# EAGLE board Arduino UNO R4 WIFI-Adavanced KIT V1.0 (EAGLE 9.5.1), part 1 of 2
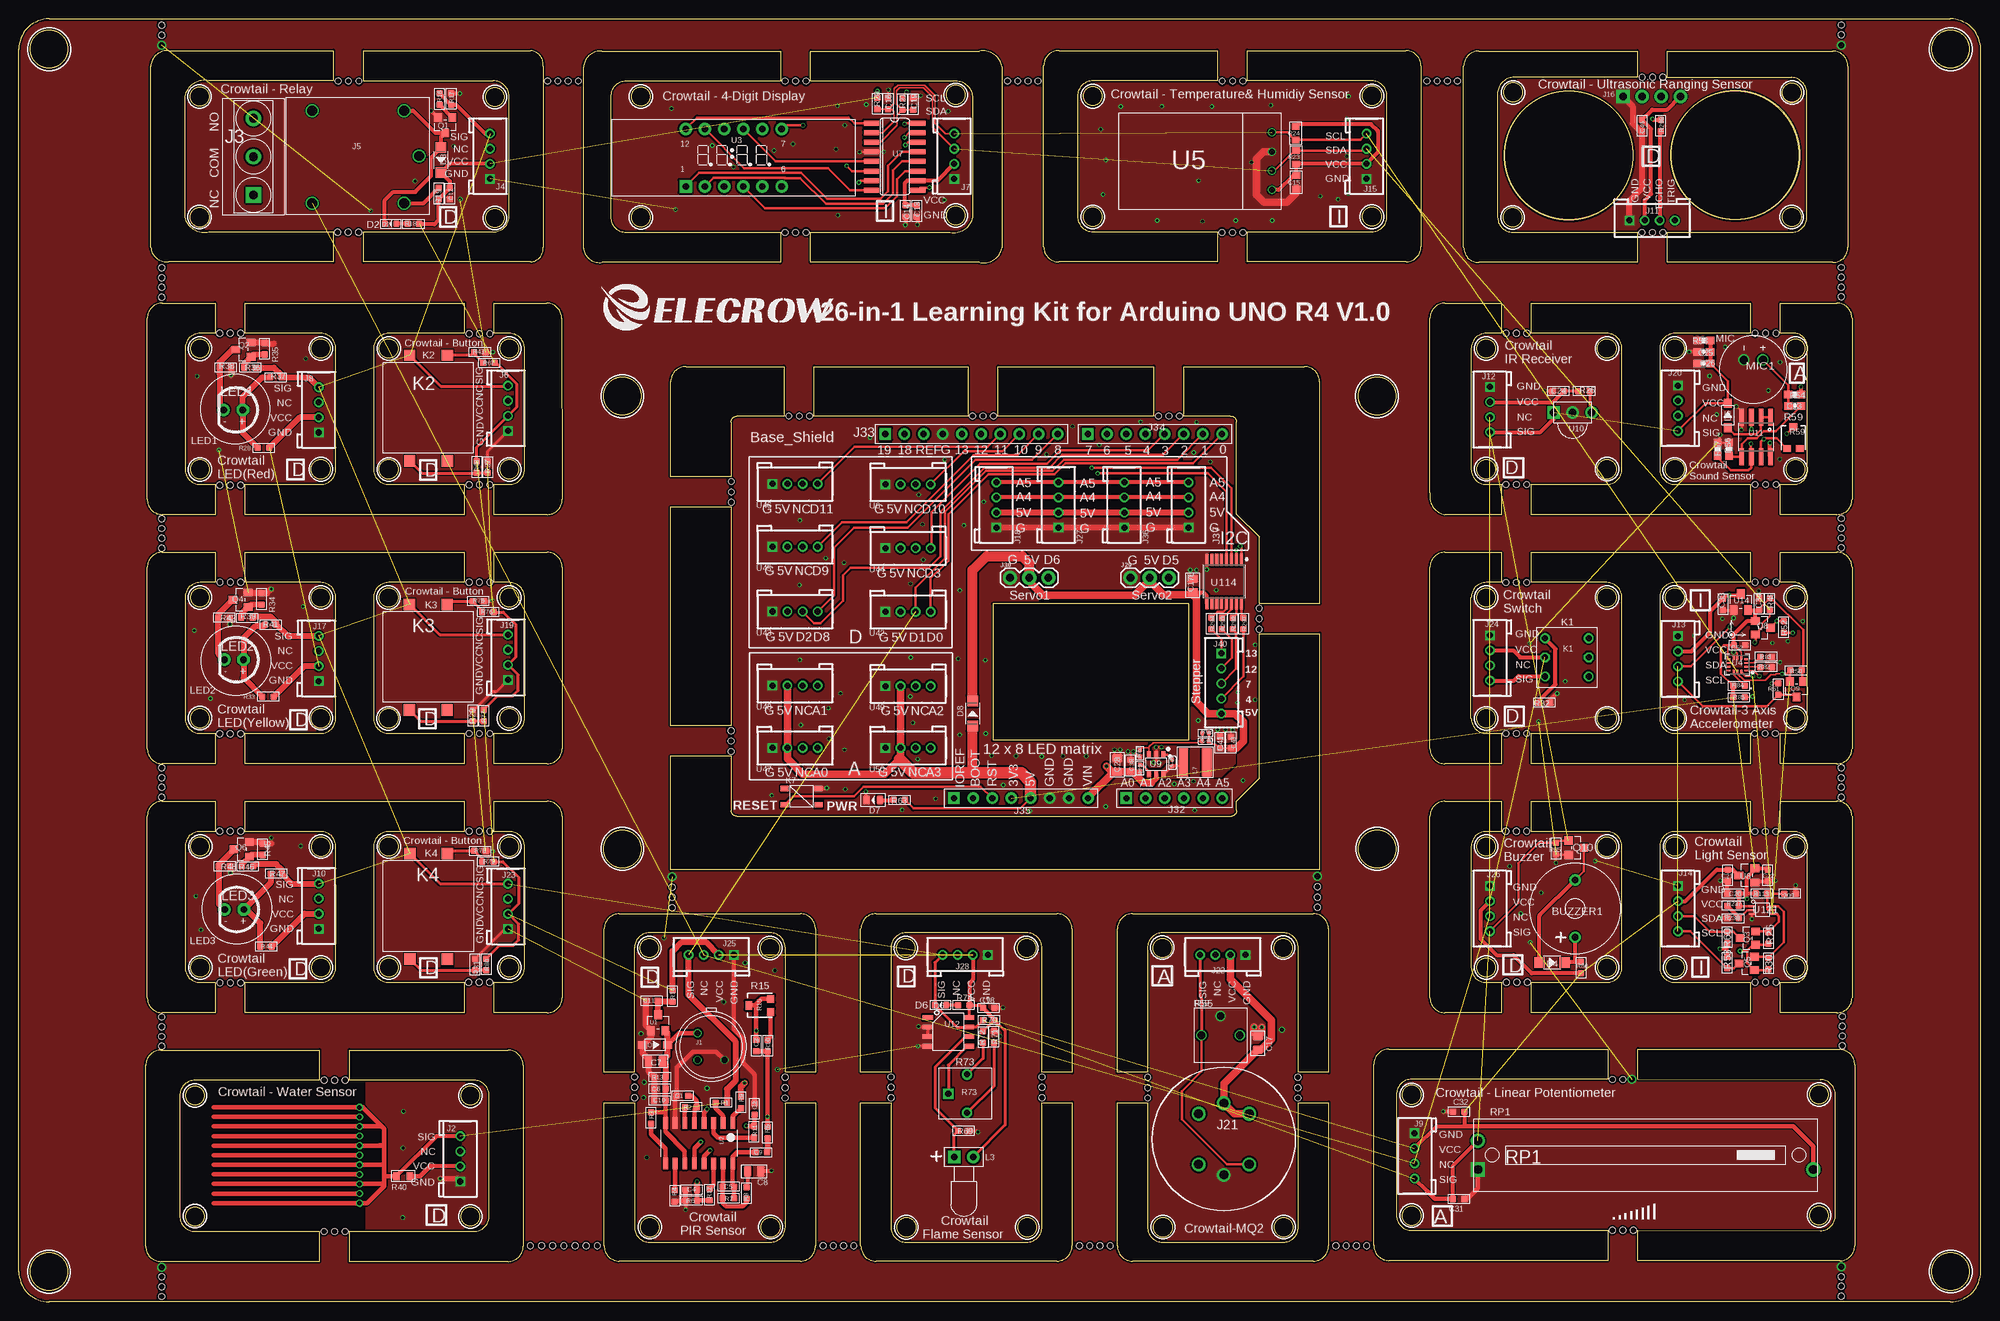
[diagram p5: board, top side]
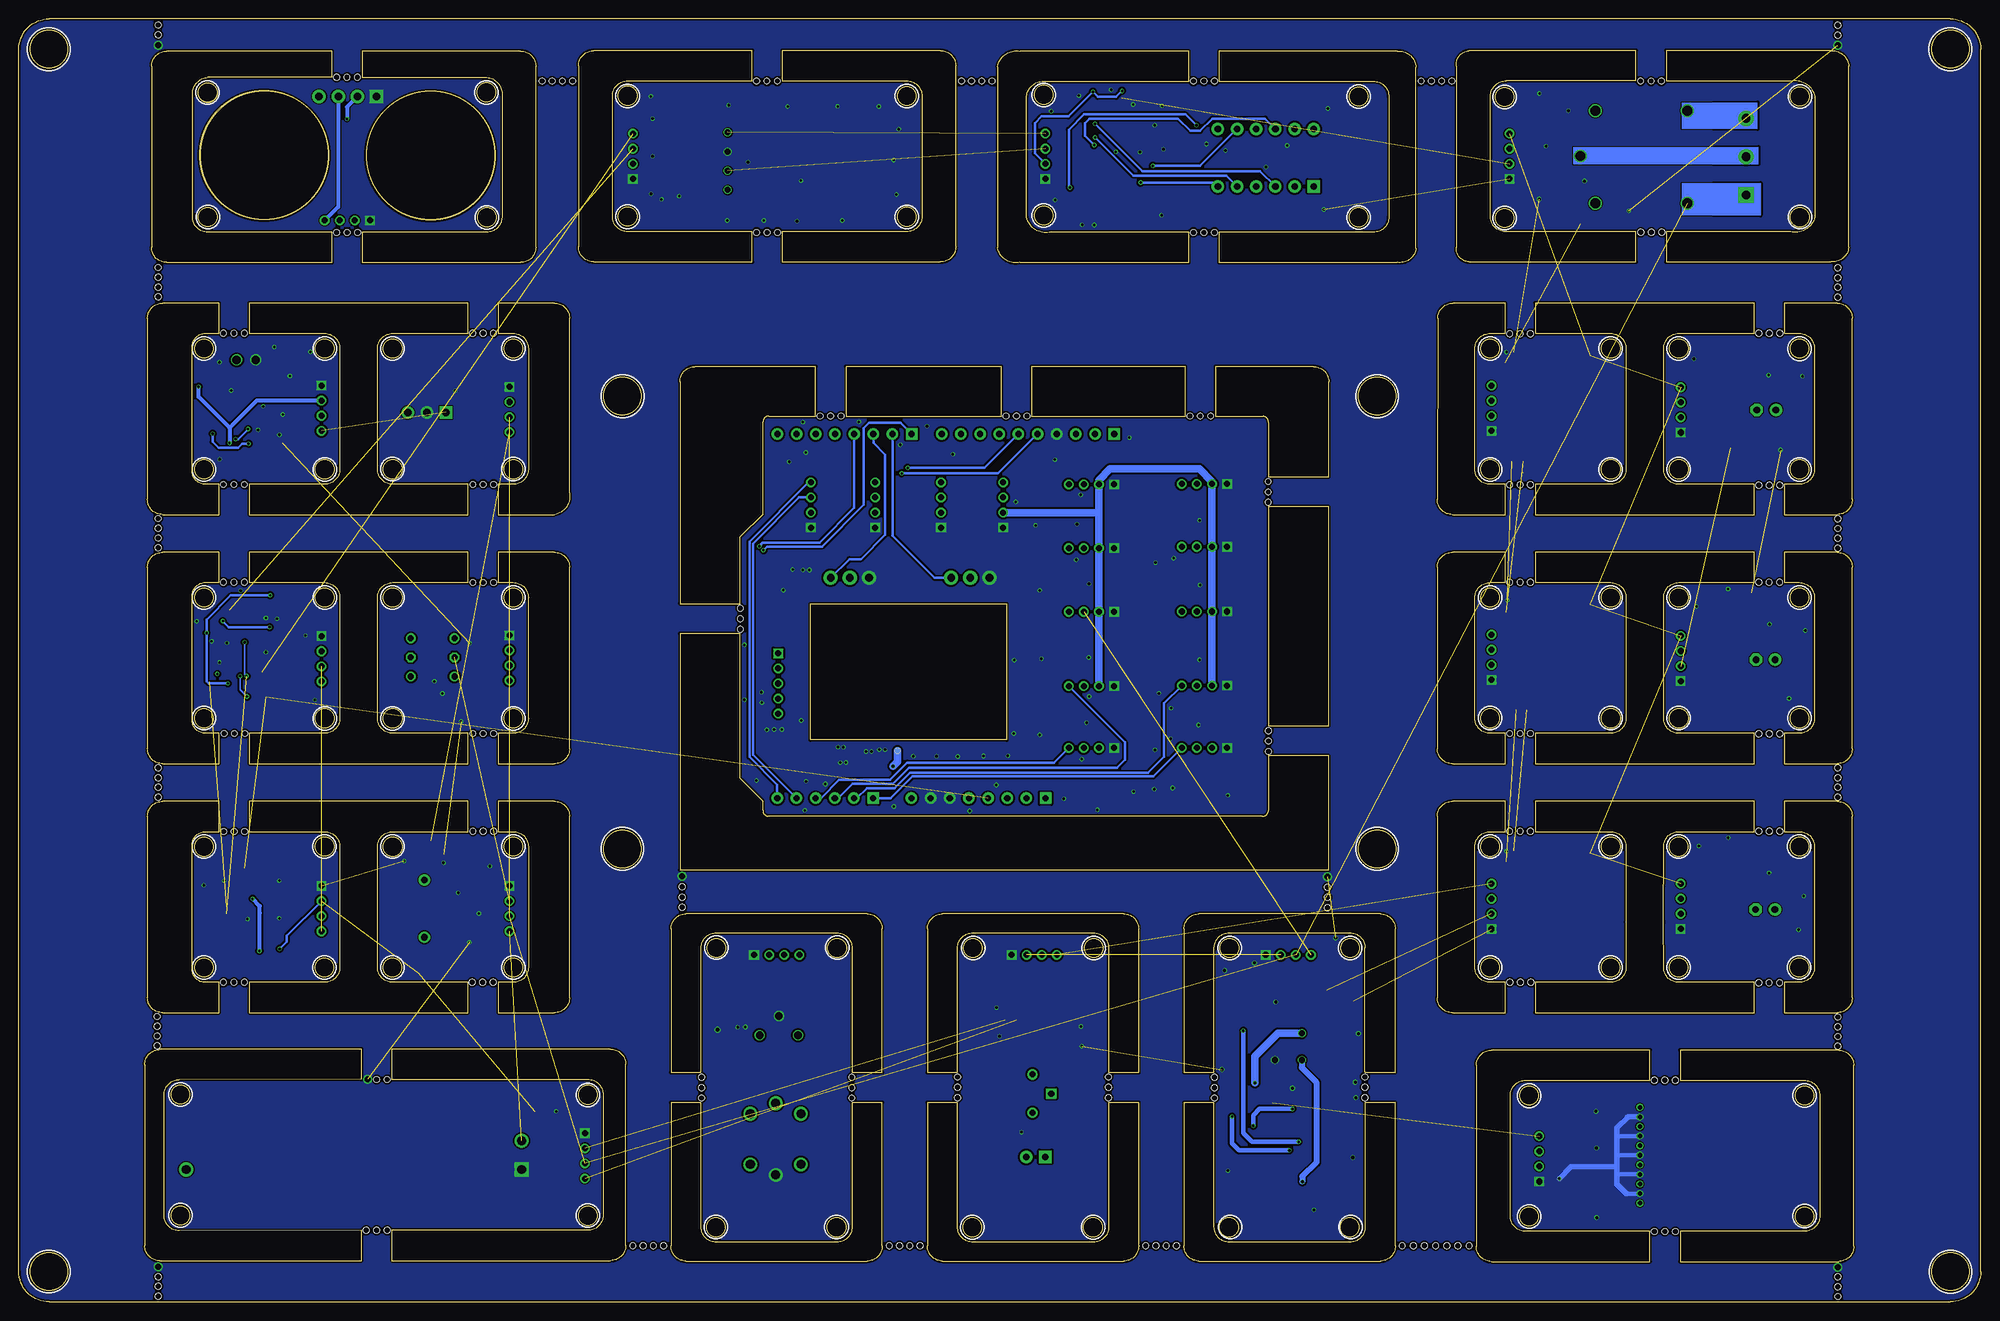
[diagram p6: board, bottom side, seen from below]

Size 260 x 170 mm. Coordinates in mm from the lower left corner, seen from the top.
Outline: 512 segments
Outline: circle at 4,4 radius 2.5
Outline: circle at 23.33,27.33 radius 1.25
Outline: circle at 24.02,60.32 radius 1.25
Outline: circle at 49.02,60.32 radius 1.25
Outline: circle at 83.56,46.91 radius 1.25
Outline: circle at 117.56,46.91 radius 1.25
Outline: circle at 24.02,93.32 radius 1.25
Outline: circle at 49.02,93.32 radius 1.25
Outline: circle at 24.02,126.32 radius 1.25
Outline: circle at 49.02,126.32 radius 1.25
Outline: circle at 65.02,126.32 radius 1.25
Outline: circle at 82.43,159.71 radius 1.25
Outline: circle at 184.58,27.44 radius 1.25
Outline: circle at 151.56,46.91 radius 1.25
Outline: circle at 256,4 radius 2.5
Outline: circle at 219.47,60.32 radius 1.25
Outline: circle at 142.32,159.78 radius 1.25
Outline: circle at 194.47,93.32 radius 1.25
Outline: circle at 219.47,93.32 radius 1.25
Outline: circle at 194.47,126.32 radius 1.25
Copper layers (1*16): Top 0.035mm / dielectric 1.5mm / Bottom 0.035mm
Design rules "default *": minimum track width 0.2mm, minimum drill 0.3mm, track to track 6mil, track to pad 6mil, pad to pad 6mil, via to via 6mil, smd to smd 6mil, copper to edge 10mil, drill to drill 6mil, minimum pad ring 3mil, minimum via ring 4mil, stop-mask expansion 4mil, vias tented up to drill 100mil, thermal gap 0mil
Net classes: 1 PWR: width 0.305 mm; 2 gnd: width 0.152 mm, drill 0.3 mm, clearance 0.152 mm
Holes 0.8 mm at 42.3,161.76 43.68,161.76 45.07,161.76 101.56,161.76 102.94,161.76 104.32,161.76 159.48,161.76 160.86,161.76 162.25,161.76 215.13,162.25 216.51,162.25 217.9,162.25 215.1,141.7 216.48,141.7 217.86,141.7 159.45,141.7 160.83,141.7 162.21,141.7 101.56,141.7 102.94,141.7 104.32,141.7 42.27,141.74 43.65,141.74 45.03,141.74 26.62,128.33 28,128.33 29.39,128.33 26.62,108.21 28,108.21 29.39,108.21 26.62,75.27 28,75.27 29.39,75.27 26.62,62.36 28,62.36 29.39,62.36 26.66,42.3 28.04,42.3 29.42,42.3 26.66,95.36 28.04,95.36 29.42,95.36 59.66,128.3 61.04,128.3 62.43,128.3 59.66,108.28 61.04,108.28 62.43,108.28 59.66,95.36 61.04,95.36 62.43,95.36 59.66,75.31 61.04,75.31 62.43,75.31 59.66,62.36 61.04,62.36 62.43,62.36 59.63,42.34 61.01,42.34 62.39,42.34 40.48,29.39 41.86,29.39 43.25,29.39 40.48,9.33 41.86,9.33 43.25,9.33 81.61,27.04 81.61,28.43 81.61,29.81 101.56,27.01 101.56,28.39 101.56,29.77 115.59,27.04 115.59,28.43 115.59,29.81 135.58,27.04 135.58,28.43 135.58,29.81 149.61,27.01 149.61,28.39 149.61,29.77 169.53,27.01 169.53,28.39 169.53,29.77 212.56,29.46 211.18,29.46 211.21,9.47 212.59,9.47 213.98,9.47 197.14,42.34 198.52,42.34 199.91,42.34 230.11,42.34 231.49,42.34 232.88,42.34 230.08,62.32 231.46,62.32 232.84,62.32 197.07,62.36 198.45,62.36 199.84,62.36 197.07,75.31 198.45,75.31 199.84,75.31 230.04,75.31 231.42,75.31 232.81,75.31 230.11,95.36 231.49,95.36 232.88,95.36 197.07,95.33 198.45,95.33 199.84,95.33 197.07,108.31 198.45,108.31 199.84,108.31 230.11,108.31 231.49,108.31 232.88,108.31 197.11,128.33 198.49,128.33 199.87,128.33 230.11,128.33 231.49,128.33 232.88,128.33 102.05,117.38 103.43,117.38 104.81,117.38 126.41,117.38 127.79,117.38 129.17,117.38 151.05,117.38 152.43,117.38 153.81,117.38 164.38,89.13 164.38,90.52 164.38,91.9 94.38,72.93 94.38,74.31 94.38,75.69 94.42,105.93 94.42,107.32 94.42,108.7 18.92,133.13 18.92,134.42 18.92,135.72 18.92,137.01 18.92,99.88 18.92,101.17 18.92,102.47 18.92,103.76 18.92,66.87 18.92,68.17 18.92,69.46 18.92,70.76 18.92,33.87 18.92,35.16 18.92,36.46 18.92,37.75 18.92,0.72 18.92,2.02 18.92,3.31 18.92,167.85 18.92,169.14 241.52,133.16 241.52,134.46 241.52,135.75 241.52,137.05 241.52,99.91 241.52,101.21 241.52,102.5 241.52,103.8 241.52,66.87 241.52,68.17 241.52,69.46 241.52,70.76 241.66,33.94 241.66,35.23 241.66,36.53 241.66,37.82 241.52,0.76 241.52,2.05 241.52,3.35 241.52,167.88 241.52,169.18 70.09,161.76 71.44,161.76 72.8,161.76 74.15,161.76 131.03,161.76 132.38,161.76 133.73,161.76 135.09,161.76 186.61,161.76 187.96,161.76 189.31,161.76 190.67,161.76 72.23,7.44 70.74,7.44 69.26,7.44 67.78,7.44 76.67,7.44 75.19,7.44 73.71,7.44 106.6,7.44 107.95,7.44 109.3,7.44 110.66,7.44 140.58,7.44 141.93,7.44 143.29,7.44 144.64,7.44 174.57,7.44 175.92,7.44 177.27,7.44 178.63,7.44 86.58,52.24 86.58,53.6 86.58,54.95 172.12,52.28 172.12,53.63 172.12,54.98

## Footprints (pad centres in the part's own frame; a part is rotated, then mirrored left to right if it is on the bottom)
2P-7.6-D12X6.5H = drill 0.9 pad 1.5: + -3.8,0; - 3.8,0
C0603 = smd 0.889 x 0.889: 1 -0.762,0; 2 0.762,0
C0805 = smd 1.016 x 1.397: 1 -0.889,0; 2 0.889,0
0603 = smd 0.889 x 0.889: 1 -0.762,0; 2 0.762,0
0603' = smd 0.889 x 1.016: 1 -0.889,0; 2 0.889,0
0603-CAP = smd 1.1 x 1: 1 -0.85,0; 2 0.85,0
C0402 = smd 0.584 x 0.584: 1 -0.45,0; 2 0.45,0
SOD123-2.7X1.6@1 = smd 1.2 x 1.02: 1 -1.635,0; 2 1.635,0
LED-0603 = smd 0.762 x 0.889: + -0.762,0; - 0.762,0
D_SOD123 = smd 1.397 x 1.397: + -1.651,0; - 1.651,0
SOD123-2.7X1.6 = smd 1.2 x 1.02: 1 1.635,0; 2 -1.635,0
LED-0805 = smd 0.889 x 1.27: + -0.889,0; - 0.889,0
D_SOD123FL = smd 1.397 x 1.397: + -1.651,0; - 1.651,0
3P-D8.1MM = drill 0.8: 1 1.778,1.778; 2 -1.778,1.778; 3 -1.778,-1.778
TWIG_2.0 = drill 0.8 pad 1.27: 1 3,0; 2 1,0; 3 -1,0 | drill 0.8 pad 1.27 square: 4 -3,0
3P-5.08 = drill 1.168 pad 2.032 square: 1 0,5.08 | drill 1.168 pad 2.032: 2 0,0; 3 0,-5.08
A_XBJ_SMART_PUMP_SONGLE_RELAY = drill 1.3: 1 3.4,14; 2 1.4,7.75; 3 3.4,1.75; 4 15.6,1.75; 5 15.6,14
CROWPI_POW_ULTRA = drill 1 pad 1.778 square: P$1 3.81,0 | drill 1 pad 1.778: P$2 1.27,0; P$3 -1.27,0; P$4 -3.81,0
2.0_1X4 = drill 0.8 pad 1.27 square: 1 -3,0 | drill 0.8 pad 1.27: 2 -1,0; 3 1,0; 4 3,0
MQ2 = drill 1.2 pad 1.8: 1 0,-6.718; 2 -1.391,-3.359; 3 0,0; 4 6.718,0; 5 8.109,-3.359; 6 6.718,-6.718
1X03 = drill 1.016 pad 1.88: 1 0,0; 2 2.54,0; 3 5.08,0
CK_1X6 = drill 0.813 pad 1.524 square: 1 0,6.35 | drill 0.813 pad 1.524: 2 0,3.81; 3 0,1.27; 4 0,-1.27; 5 0,-3.81; 6 0,-6.35
CK_1X10 = drill 0.813 pad 1.524 square: 1 0,0 | drill 0.813 pad 1.524: 2 0,-2.54; 3 0,-5.08; 4 0,-7.62; 5 0,-10.16; 6 0,-12.7; 7 0,-15.24; 8 0,-17.78; 9 0,-20.32; 10 0,-22.86
CK_1X8 = drill 0.813 pad 1.524 square: 1 0,8.89 | drill 0.813 pad 1.524: 2 0,6.35; 3 0,3.81; 4 0,1.27; 5 0,-1.27; 6 0,-3.81; 7 0,-6.35; 8 0,-8.89
TWIG-2.0-5PIN = drill 0.8 pad 1.27: 1 8.048,0; 2 6.048,0; 3 4.048,0; 4 2.048,0 | drill 0.8 pad 1.27 square: 5 0.048,0
6P-2CH-8X8 = drill 0.813 pad 1.27: 1 -2.9,2.54; 3 -2.9,-2.54; 4 2.9,-2.54; 6 2.9,2.54 | drill 0.813 pad 1.27 octagon: 2 -2.9,0; 5 2.9,0
12X12 = smd 1.5 x 1.5: P$1 0,0; P$2 14,0; P$3 14,-5; P$4 0,-5
SMD_KEY4.2*3.*.2.5 = smd 1 x 0.7: P$1 -2.184,0.102; P$2 2.316,0.102; P$3 -2.184,-2.048; P$4 2.316,-2.048
CK_1*2 = drill 0.889 pad 1.651 square: 1 0,1.27 | drill 0.889 pad 1.651: 2 0,-1.27
L_4X4 = smd 3.7 x 1.2: 1 0,2.159; 2 0,-0.94
LED-2P-2.54-6MM = drill 0.889 pad 1.651 octagon: + -1.27,0 | drill 0.889 pad 1.651: - 1.27,0
2P-D8.9MM = drill 1.1: 1 -1.27,1.27; 2 -1.27,-1.27
PAD-1.0MM = smd 1 x 1: P$1 0,0
SOT23@1 = smd 1.016 x 1.143: 1 -0.95,-1.016; 2 0.95,-1.016; 3 0,1.016
SOT23@2 = smd 1.016 x 1.143: 1 -0.889,-1.016; 2 0.889,-1.016; 3 0,1.016
DISCRETE_SOT23 = smd 1.1 x 1.1: 1 -0.95,-1.016; 2 0.95,-1.016; 3 0,1.016
R0603 = smd 0.889 x 0.889: 1 -0.762,0; 2 0.762,0
3P-SMD-SQUA-3.6X3.3 = smd 1 x 0.9: 1 -0.85,-1.45; 3 0.85,-1.45 | smd 1.1 x 0.9: 2 0,1.45
R0402 = smd 0.584 x 0.584: 1 -0.445,0; 2 0.445,0
0603-RES = smd 1.1 x 1: 1 -0.85,0; 2 0.85,0
PACKAGE__RESISTANCE = drill 1.016: 1 -2.286,-0.254; 2 0.254,-2.794; 3 2.794,-0.254
3P-SQUA-7X6.8 = drill 0.8 pad 1.35: 1 -2.54,-0.25; 2 2.54,-0.25 | drill 0.8 pad 1.35 square: 3 0,2.25
3P-SQUA-45.6X10X5.8H = drill 1.143 pad 1.905 square: 1 -22.225,-1.905 | drill 1.143 pad 1.905: 2 -22.225,1.905; 3 22.225,-1.905
SOT23 = smd 1.016 x 1.2: 1 -0.95,-1.06; 2 0.95,-1.06; 3 0,1.06
SOP16 = smd 0.635 x 1.524: 1 0,0; 2 1.27,0; 3 2.54,0; 4 3.81,0; 5 5.08,0; 6 6.35,0; 7 7.62,0; 8 8.89,0; 9 8.89,5.334; 10 7.62,5.334; 11 6.35,5.334; 12 5.08,5.334; 13 3.81,5.334; 14 2.54,5.334; 15 1.27,5.334; 16 0,5.334
MODULE_7-4-SEG/CLOCK-2.54-32.2*10.2*5.8 = drill 0.889 pad 1.651 square: 1 9.75,1.29 | drill 0.889 pad 1.651: 2 12.29,1.29; 3 14.83,1.29; 4 17.37,1.29; 5 19.91,1.29; 6 22.45,1.29; 7 22.45,8.91; 8 19.91,8.91; 9 17.37,8.91; 10 14.83,8.91; 11 12.29,8.91; 12 9.75,8.91
LGA-14L = smd 0.475 x 0.25: 1 -1.163,0.75; 2 -1.163,0.25; 3 -1.163,-0.25; 4 -1.163,-0.75; 8 1.163,-0.75; 9 1.163,-0.25; 10 1.163,0.25; 11 1.163,0.75 | smd 0.25 x 0.475: 5 -0.5,-0.912; 6 0,-0.912; 7 0.5,-0.912; 12 0.5,0.912; 13 0,0.912; 14 -0.5,0.912
DHT20 = drill 0.8: 1 -3.81,-3.81; 2 -1.27,-3.81; 3 1.27,-3.81; 4 3.81,-3.81
SO16 = smd 0.66 x 2.032: 1 -4.445,-3.073; 2 -3.175,-3.073; 3 -1.905,-3.073; 4 -0.635,-3.073; 5 0.635,-3.073; 6 1.905,-3.073; 7 3.175,-3.073; 8 4.445,-3.073; 9 4.445,3.073; 10 3.175,3.073; 11 1.905,3.073; 12 0.635,3.073; 13 -0.635,3.073; 14 -1.905,3.073; 15 -3.175,3.073; 16 -4.445,3.073
SOT23-6L = smd 0.5 x 0.9: 1 -0.961,-1.212; 2 -0.011,-1.212; 3 0.94,-1.212; 4 0.94,1.288; 5 -0.011,1.288; 6 -0.961,1.288
3P-2.54-4.8X5X6.95H = drill 1 pad 1.65 square: 1 -2.54,0 | drill 1 pad 1.65: 2 0,0; 3 2.54,0
SO08 = smd 0.61 x 2.21: 1 -1.905,-2.616; 2 -0.635,-2.616; 3 0.635,-2.616; 4 1.905,-2.616; 5 1.905,2.616; 6 0.635,2.616; 7 -0.635,2.616; 8 -1.905,2.616
SOIC8-6.0 = smd 0.6 x 1.4: 1 -1.905,-2.7; 2 -0.635,-2.7; 3 0.635,-2.7; 4 1.905,-2.7; 5 1.905,2.7; 6 0.635,2.7; 7 -0.635,2.7; 8 -1.905,2.7
SOP65P640X120-16N = smd 1.572 x 0.41: 1 -2.872,2.275; 2 -2.872,1.625; 3 -2.872,0.975; 4 -2.872,0.325; 5 -2.872,-0.325; 6 -2.872,-0.975; 7 -2.872,-1.625; 8 -2.872,-2.275; 9 2.872,-2.275; 10 2.872,-1.625; 11 2.872,-0.975; 12 2.872,-0.325; 13 2.872,0.325; 14 2.872,0.975; 15 2.872,1.625; 16 2.872,2.275
B1750 = smd 0.8 x 0.27: 1 0,0; 2 0,-0.5; 3 0,-1; 4 2.8,-1; 5 2.8,-0.5; 6 2.8,0

## Placement (x,y rotation side)
BUZZER1  [2P-7.6-D12X6.5H]  206.25,52.11 90 top
C1  10nF  [C0603]  87.96,27.31 180 top
C2  10nF  [C0603]  97.48,25.57 90 top
C3  22nF  [C0603]  97.73,33.95 90 top
C4  10nF  [C0603]  89.15,14.86 0 top
C5  22nF  [C0603]  94.05,15.28 180 top
C6  10nF  [C0603]  84.94,28.24 0 top
C7  22uF  [C0805]  84.36,31.89 0 top
C8  47uF  [C0805]  97.46,17.29 180 top
C9  10uF  [0603]  98.37,19.8 180 top
C10  100nF  [C0603]  84.94,26.68 180 top
C11  100nF  [C0603]  83.88,39.9 0 top
C12  1uF  [0603]  57.12,146.85 90 top
C13  10uF  [C0603]  118.98,144.54 270 top
C14  100nF  [C0603]  117.48,144.55 270 top
C15  100nF  [0603']  169.31,148.35 270 top
C16  1nF  [C0603]  115.19,158.78 90 top
C17  22uF  [C0805]  164.2,34.29 270 top
C18  100nF  [C0603]  128.51,38.96 0 top
C19  1nF  [C0603]  118.54,158.71 90 top
C20  1uF  [C0603]  227.19,54.11 0 top
C21  10uf  [C0603]  226.49,56.51 90 top
C22  10uf  [C0603]  231.79,56.51 90 top
C23  0.1uF  [0603-CAP]  235.37,118.72 0 top
C24  100nf  [C0603]  204.01,120.69 0 top
C25  0.1uF  [0603-CAP]  223.31,125.87 0 top
C26  0.1uF  [0603-CAP]  223.31,124.36 0 top
C28  22uF/25V  [C0805]  145.59,71.14 270 top
C31  100nF  [C0603]  190.84,13.63 180 top
C32  100nF  [C0603]  190.84,25.19 0 top
C33  10uf  [C0603]  225.86,92.43 90 top
C34  10uf  [C0603]  230.64,92.48 270 top
C38  1uF/25V  [C0603]  147.3,71.07 90 top
C39  100F/16V  [C0402]  152.87,71.42 90 top
C40  220pF/16V  [C0402]  157.24,74.29 0 top
C41  22uF/16V  [C0603]  159.17,74.11 270 top
C43  1uF/16V  [C0603]  160.64,74.12 90 top
C46  100nF  [C0603]  215.11,155.85 270 top
C52  100nF  [C0603]  228.07,87.01 180 top
C176  10uF  [C0805]  155.57,94.94 90 top
C209  100nF  [C0603]  234.72,54.09 180 top
D1  CESD5V0D1  [SOD123-2.7X1.6@1]  84.32,34.04 0 top
D2  Green  [LED-0603]  49.26,142.84 180 top
D3  1N4148  [D_SOD123]  55.95,151.29 270 top
D4  1N4148  [D_SOD123]  203.2,44.96 0 top
D5  MBR0520  [SOD123-2.7X1.6]  226.5,117.46 90 top
D6  Green  [LED-0603]  122.16,39.33 180 top
D7  RED  [LED-0805]  113.22,66.5 180 top
D8  DSK24  [D_SOD123FL]  126.41,77.97 90 top
J1  D203B  [3P-D8.1MM]  91.76,33.83 90 top
J2  TWIG_2.0TWIG2.0  [TWIG_2.0]  58.51,18.95 90 top
J3  [3P-5.08]  31.09,151.74 180 top
J4  TWIG_2.0TWIG2.0  [TWIG_2.0]  62.45,151.8 90 top
J5  SRD-05VDC-SL-C  [A_XBJ_SMART_PUMP_SONGLE_RELAY]  54.46,159.58 180 top
J6  TWIG_2.0TWIG2.0  [TWIG_2.0]  64.83,118.41 90 top
J7  TWIG_2.0TWIG2.0  [TWIG_2.0]  123.96,151.8 90 top
J8  TWIG_2.0TWIG2.0  [TWIG_2.0]  39.75,118.19 90 top
J9  TWIG_2.0TWIG2.0  [TWIG_2.0]  184.98,19.34 270 top
J10  TWIG_2.0TWIG2.0  [TWIG_2.0]  39.75,52.43 90 top
J11  TWIG_2.0TWIG2.0  [TWIG_2.0]  216.47,143.3 0 top
J12  TWIG_2.0TWIG2.0  [TWIG_2.0]  194.97,118.23 270 top
J13  TWIG_2.0TWIG2.0  [TWIG_2.0]  219.89,85.21 270 top
J14  TWIG_2.0TWIG2.0  [TWIG_2.0]  219.89,52.11 270 top
J15  TWIG_2.0TWIG2.0  [TWIG_2.0]  178.62,151.8 90 top
J16  CROWPI_POW_ULTRA  [CROWPI_POW_ULTRA]  216.4,159.73 180 top
J17  TWIG_2.0TWIG2.0  [TWIG_2.0]  39.75,85.24 90 top
J18  TWIG_2.0  [2.0_1X4]  129.54,105.59 90 top
J19  TWIG_2.0TWIG2.0  [TWIG_2.0]  64.83,85.41 90 top
J20  TWIG_2.0TWIG2.0  [TWIG_2.0]  219.89,118.41 270 top
J21  Gas Sensor Socket  [MQ2]  163.06,24.93 270 top
J22  TWIG_2.0TWIG2.0  [TWIG_2.0]  159.56,45.99 180 top
J23  TWIG_2.0TWIG2.0  [TWIG_2.0]  64.83,52.41 90 top
J24  TWIG_2.0TWIG2.0  [TWIG_2.0]  194.97,85.32 270 top
J25  TWIG_2.0TWIG2.0  [TWIG_2.0]  91.76,45.99 180 top
J26  TWIG_2.0TWIG2.0  [TWIG_2.0]  194.97,52.11 270 top
J27  TWIG_2.0  [2.0_1X4]  137.78,105.59 90 top
J28  TWIG_2.0TWIG2.0  [TWIG_2.0]  125.43,45.99 180 top
J29  SERVO_2  [1X03]  147.33,95.94 0 top
J30  SERVO_1  [1X03]  131.37,95.94 0 top
J32  CL_1X6  [CK_1X6]  153.14,66.74 90 top
J33  CK_1X10  [CK_1X10]  114.83,115 90 top
J34  CK_1X8  [CK_1X8]  150.56,115 90 top
J35  CK_1X8DD  [CK_1X8]  132.82,66.74 90 top
J36  TWIG_2.0  [2.0_1X4]  146.51,105.59 90 top
J37  TWIG_2.0  [2.0_1X4]  155.03,105.59 90 top
J40  TWIG_2.0_5PIN  [TWIG-2.0-5PIN]  159.37,85.98 270 top
K1  Self-lock button  [6P-2CH-8X8]  205.16,85.4 0 top
K2  12X12  [12X12]  51.8,111.42 90 top
K3  12X12  [12X12]  51.76,78.42 90 top
K4  12X12  [12X12]  51.81,45.42 90 top
K7  TS3425BA  [SMD_KEY4.2*3.*.2.5]  103.67,67.92 0 top
L3  [CK_1*2]  125.23,19.21 90 top
L7  FNR4020S4R7MT  [L_4X4]  156.51,71.49 90 top
LED1  [LED-2P-2.54-6MM]  28.41,118.19 180 top
LED2  [LED-2P-2.54-6MM]  28.51,85.09 180 top
LED3  [LED-2P-2.54-6MM]  28.54,51.98 180 top
MIC1  microphone  [2P-D8.9MM]  229.88,123.54 270 top
P1  PADPAD-1.0MM  [PAD-1.0MM]  143.56,73.03 0 bottom
Q1  S9013  [SOT23@1]  56.51,155.9 180 top
Q2  S9013  [SOT23@1]  29.78,126.19 90 top
Q3  BSN20  [SOT23@2]  229.14,48.2 90 top
Q4  S9013  [SOT23@1]  29.38,93.03 90 top
Q5  BSN20  [SOT23@2]  228.99,44.85 90 top
Q6  S9013  [SOT23@1]  29.55,59.98 90 top
Q8  BSN20  [SOT23@2]  231.16,89.33 270 top
Q9  BSN20  [SOT23@2]  235.6,81.18 180 top
Q10  S9013  [DISCRETE_SOT23]  206.41,60.18 270 top
R1  10K  [R0603]  93.08,26.41 180 top
R2  4.7M  [R0603]  89.08,25.82 180 top
R3  10K  [R0603]  83.77,24.4 270 top
R4  1M  [R0603]  86.92,14.06 90 top
R5  1K  [R0603]  99.21,22.44 90 top
R6  10K  [R0603]  89.15,13.41 0 top
R7  1M_1%  [R0603]  94.05,13.73 180 top
R8  3.3K  [R0603]  96.42,14.4 270 top
R9  10K  [R0603]  95.7,26.43 270 top
R10  130K  [R0603]  99.23,33.95 270 top
R11  10K  [R0603]  97.43,22.54 90 top
R12  0R  [R0603]  91.51,14.22 270 top
R13  100K  [R0603]  84.95,29.8 180 top
R14  13R  [R0603]  86.62,40.51 90 top
R15  500K  [3P-SMD-SQUA-3.6X3.3]  98.19,39.29 90 top
R16  2K  [R0603]  55.75,159.38 270 top
R17  10K  [R0603]  57.3,159.4 270 top
R18  4.7K  [R0603]  52.29,142.83 180 top
R19  0R  [R0603]  55.66,146.86 90 top
R20  10K  [R0603]  113.77,158.77 270 top
R21  10K  [R0603]  117.09,158.71 270 top
R22  10K  [R0402]  148.6,70.72 270 top
R23  4.7KK  [0603']  169.26,151.65 270 top
R24  4.7K  [0603']  169.21,154.85 90 top
R25  10K  [R0603]  231.89,48.2 90 top
R26  330  [R0603]  207.44,120.69 0 top
R27  10K/NC  [R0603]  62.13,110.6 270 top
R28  100R  [R0603]  32.44,113.15 180 top
R29  10K/NC  [R0603]  60.17,77.7 270 top
R30  10K  [R0603]  231.89,44.85 270 top
R31  10K/NC  [R0603]  60.44,44.71 270 top
R32  10K  [R0603]  202.18,79.41 180 top
R33  100R  [R0603]  33.04,80.2 180 top
R34  NC  [R0603]  32.17,93.13 270 top
R35  NC  [R0603]  32.57,126.29 270 top
R36  0R  [R0603]  30.64,123.8 180 top
R37  NC  [R0603]  34.04,122.5 0 top
R38  NC  [R0603]  27.4,123.83 0 top
R39  0R  [R0603]  30.24,90.64 180 top
R40  1M  [0603']  50.92,16.65 0 top
R41  NC  [R0603]  33.36,89.72 0 top
R42  NC  [R0603]  27.21,90.67 0 top
R43  0R  [R0603]  61.1,125.85 0 top
R44  47R  [R0603]  32.77,47.09 180 top
R45  NC  [R0603]  32.3,59.98 270 top
R46  0R  [R0603]  30.3,57.7 180 top
R47  NC  [R0603]  34.11,56.75 0 top
R48  NC  [R0603]  27.27,57.72 0 top
R49  10K  [R0603]  232.04,92.48 270 top
R50  10K  [R0603]  235.54,83.67 0 top
R51  10K  [R0603]  233.19,81.18 90 top
R52  10K  [R0603]  233.9,89.41 270 top
R53  10K  [R0603]  226.42,44.96 90 top
R54  10k  [0603-RES]  235.34,120.22 0 top
R55  10K  [PACKAGE__RESISTANCE]  159.53,35.08 180 top
R56  10k  [0603-RES]  226.63,112.99 270 top
R57  2.2k  [0603-RES]  225.13,112.99 270 top
R58  100k  [0603-RES]  223.31,127.38 180 top
R59  500k  [3P-SMD-SQUA-3.6X3.3]  235.18,114.51 0 top
R60  10K  [R0603]  226.42,48.31 270 top
R61  8.06k  [R0402]  148.6,72.68 90 top
R62  42.2K  [R0402]  157.28,75.38 0 top
R63  1k  [0603]  116.69,66.5 180 top
R65  4.7K  [R0603]  203.72,60.07 90 top
R66  22R  [R0603]  207.04,44.28 270 top
R67  0R/NC  [R0603]  62.32,124.41 0 top
R68  10K  [R0603]  60.68,110.62 270 top
R69  10K  [R0603]  125.22,22.68 180 top
R70  3K  [R0603]  128.55,37.34 180 top
R71  100R  [R0603]  129.21,35.11 270 top
R72  100R  [R0603]  127.79,35.08 90 top
R73  1K  [3P-SQUA-7X6.8]  125.43,27.59 90 top
R74  1K  [R0603]  125.22,39.33 0 top
R75  0R  [R0603]  60.89,92.84 0 top
R76  0R/NC  [R0603]  62.18,91.41 0 top
R77  10K  [R0603]  61.62,77.69 270 top
R78  0R  [R0603]  61.13,59.77 0 top
R79  0R/NC  [R0603]  62.18,58.33 0 top
R80  10K  [R0603]  61.94,44.72 270 top
R82  0R  [R0603]  231.57,84.11 180 top
R83  0R  [R0603]  231.57,85.51 180 top
R84  4.7K  [R0603]  227.97,81.61 0 top
R85  4.7K  [R0603]  227.97,80.11 0 top
R113  10K  [R0603]  230.99,54.11 180 top
R237  10K  [R0603]  227.19,52.51 0 top
R238  NC  [R0603]  227.19,50.81 0 top
R292  22R  [R0603]  160.89,89.86 270 top
R293  22R  [R0603]  159.47,89.86 270 top
R294  22R  [R0603]  158.06,89.86 270 top
R297  22R  [R0603]  162.31,89.86 270 top
R299  2K  [R0603]  217.61,155.85 270 top
RP1  [3P-SQUA-45.6X10X5.8H]  215.6,19.44 0 top
U1  XC6206P332MR-G  [SOT23]  84.71,37.01 0 top
U2  BIS0001  [SOP16]  94.61,23.69 180 top
U3  [MODULE_7-4-SEG/CLOCK-2.54-32.2*10.2*5.8]  78.64,146.5 0 top
U4  LSM6DS3TR-C  [LGA-14L]  227.77,84.41 180 top
U5  DHT20  [DHT20]  162.24,151.14 90 top
U6  TWIG_2.0  [2.0_1X4]  117.85,108.32 0 top
U7  TM1650  [SO16]  116.08,151.74 270 top
U8  XC6206MR-3.3  [SOT23]  228.99,56.51 90 top
U9  HM8342Y  [SOT23-6L]  150.73,71.28 180 top
U10  TSOP382  [3P-2.54-4.8X5X6.95H]  205.92,117.85 0 top
U11  LMV358  [SO08]  230.24,114.61 180 top
U12  [SOIC8-6.0]  123.18,35.78 270 top
U14  XC6206MR-3.3  [SOT23]  228.23,92.73 0 top
U42  TWIG_2.0  [2.0_1X4]  117.85,91.44 0 top
U43  TWIG_2.0  [2.0_1X4]  102.87,91.48 0 top
U44  TWIG_2.0  [2.0_1X4]  117.85,99.88 0 top
U45  TWIG_2.0  [2.0_1X4]  102.87,100.05 0 top
U46  TWIG_2.0  [2.0_1X4]  102.87,108.38 0 top
U47  TWIG_2.0  [2.0_1X4]  102.87,73.41 0 top
U48  TWIG_2.0  [2.0_1X4]  102.87,81.67 0 top
U49  TWIG_2.0  [2.0_1X4]  117.85,81.6 0 top
U50  TWIG_2.0  [2.0_1X4]  117.85,73.41 0 top
U114  ULN2003AMT/TR  [SOP65P640X120-16N]  159.73,95.45 270 top
U121  BH1750  [B1750]  229.69,52.41 0 top

## Tracks (layer width: path | path; a pad name or v marks a point on that pad's centre or on a via)
3V3  (via drill 0.35)  (2 unrouted)
  Top 0.2: U4.8 226.6,85.17 226.47,85.31 226.47,86.87 226.6,87.01 C52.2 228.27,86.05 U4.5
  Top 0.3: U14.2 229.18,91.37 | U121.1 228.05,52.41 R237.2 | R30.2 231.76,43.96 Q5.1 229.09,44.88 229.09,46.61 | R25.1 231.76,47.31 Q3.1 229.79,47.31 229.09,46.61 | R84.1 225.6,83.22 225.6,86.61 225.99,87.01 C52.2 | v228.12,46.5 228.98,46.5 229.09,46.61
  Top 0.305: Q8.1 230.14,90.41 | 229.24,91.61 U14.2 | Q9.1 236.36,82.32 236.36,83.67 R50.2 236.47,83.84 236.47,89.06 232.29,93.24 R49.1 230.64,91.84 C34.2 230.4,91.61
  Top 0.5: U14.2 230.59,91.67 C34.2 230.54,91.72 230.14,91.32 Q8.1 229.08,90.22 227.3,88.45 C52.2 | C22.2 231.6,57.46 U8.2 230.05,57.24 228.98,56.17 228.98,54.21 228.89,54.11 | R237.2 C20.2 228.89,54.11 | 228.89,54.11 R113.2 | v229.03,53.4 229.03,53.97 228.89,54.11 | R85.1 R84.1
  Bottom 0.5: v228.12,46.5 228.12,51.51 228.08,51.54 228.08,52.45 v229.03,53.4
5V  (via drill 0.35)
  Top 0.5: v236.18,121.25 236.19,121.24 R54.2 | U11.8 232.07,112.06 v232.07,113.81
  Bottom 0.5: J20.3 228.47,119.41 232.07,115.8 | 232.07,115.8 v232.07,113.81 | 232.07,115.8 236.17,119.9 236.17,121.24 v236.18,121.25
5V_10  (via drill 0.3)
  Top 0.305: U14.3 228.05,93.62 v226.7,93.62 226.4,93.62 226.08,93.3 225.97,93.2 | R52.2 235.11,88.65 v235.12,88.64 | R51.2 v232.3,81.94
  Top 0.4: 224.17,90.71 224.17,91.5 C33.2 225.97,93.2
  Top 0.406: v226.7,93.62 228.23,93.62 U14.3
  Top 0.5: J13.3 221.67,86.21 224.17,88.71 224.17,91.5 225.96,93.3 226.08,93.3 | C33.2 226.29,93.62 228.23,93.62
  Bottom 0.305: v235.12,88.64 235.12,88.14 | v235.12,88.64 235.12,90.41 231.91,93.62 v226.7,93.62 | v232.3,81.94 234.84,81.94 235.12,82.22 v235.12,88.64
A
  Top 0.3: U3.11 96.13,150.21 107.23,150.21 110.13,147.3 U7.8
A0
  Bottom 0.3: J32.1 144.44,66.74 141.54,69.64 109.64,69.64 U47.4
A1
  Bottom 0.3: J32.2 148.96,66.74 147.62,68.08 143.97,68.08 141.92,70.13 110.36,70.13 108.25,72.24 108.25,79.29 U48.4
A2
  Bottom 0.3: J32.3 151.4,66.74 149.51,68.63 144.17,68.63 142.02,70.79 114.47,70.79 113.42,71.84 113.42,74.17 U49.4
A3
  Bottom 0.3: J32.4 153.69,66.74 151.27,69.16 144.56,69.16 142.26,71.46 122.8,71.46 U50.4
A4
  Top 0.5: J37.3 J36.3 J27.3 J18.3
  Bottom 0.3: J32.5 162.7,72.49 162.7,100.47 156.59,106.59 J37.3
A5
  Top 0.5: J18.4 J27.4 J36.4 J37.4
  Bottom 0.3: J32.6 159.49,68.52 163.19,72.23 163.19,100.74 155.35,108.59 J37.4
B  (via drill 0.35)
  Top 0.3: U3.7 101.59,155.91 v103.94,155.91 | v120.7,147.65 119.5,147.65 U7.9
  Bottom 0.3: v103.94,155.91 105.37,157.35 118.81,157.35 120.84,155.32 120.84,147.79 v120.7,147.65
C
  Top 0.3: U3.4 98.88,144.92 114.82,144.92 116.4,146.5 116.4,148.77 117.46,149.84 U7.11
COM
  Bottom 0.2: J3.2 52.97,151.74 J5.2
  Bottom 1.524: 31.18,151.83 J3.2
D
  Top 0.3: U3.2 92.05,148.92 101.55,148.92 101.56,148.91 103.52,148.91 106.95,145.48 114.51,145.48 115.84,146.81 115.84,149.93 117.02,151.11 U7.12
D0
  Top 0.3: U42.4 120.85,95.86 123.22,98.23 123.22,104.36 128.51,109.64 137.28,109.64 138.72,111.09 155.61,111.09 159.45,114.93 J34.8
D1  (via drill 0.6)  (2 unrouted)
  Top 0.3: U42.3 118.85,94.6 122.77,98.51 122.77,104.7 128.16,110.1 136.97,110.1 138.49,111.61 153.53,111.61 J34.7
  Top 0.5: J2.1 55.34,21.95 R40.1
  Top 0.6: 48.41,17.08 48.41,16.02 48.41,15.3
  Top 0.61: 50.06,16.67 R40.1 48.53,16.65 48.41,16.78 48.41,17.08 48.41,17.95 | 48.36,15.25 46.18,13.08 v45.15,13.08 25.85,13.08 | 48.36,15.25 48.41,15.3 48.09,15.62 | 48.41,20.75 48.41,22.94 48.11,23.24 | 48.41,20.75 48.41,17.95 | 48.18,18.18 48.2,18.16 | 48.36,15.25 48.29,15.32 48.29,15.64 48.41,15.75 48.41,16.02 | 48.37,20.72 48.41,20.75 | 25.85,18.16 v45.15,18.16 48.2,18.16 | 25.85,15.62 v45.15,15.62 48.09,15.62 | v45.15,20.7 25.85,20.7 | 25.85,25.78 v45.15,25.78 45.66,25.78 45.66,25.73 48.11,23.28 48.11,23.24 | 25.85,23.24 v45.15,23.24 48.11,23.24 | 45.66,20.7 v45.15,20.7 | 48.09,15.62 48.13,15.62 | v45.15,20.7 47.69,20.7 | 48.21,20.7 47.69,20.7 | 48.2,18.16 48.41,17.95 | 47.69,20.7 47.74,20.75 48.41,20.75
  Top 0.762: R1.1 93.84,28.17 94.97,29.3 94.97,34.51 88.76,40.72
  Top 0.8: 88.76,40.72 J25.1
D2
  Top 0.3: J34.6 151.6,112.23 138.25,112.23 136.57,110.55 127.98,110.55 122.13,104.7 122.13,98.77 120.65,97.29 110.24,97.29 109.22,96.27 109.22,92.88 106.28,89.94 105.41,89.94 U43.3
D3
  Top 0.3: J34.5 149.66,112.83 138.03,112.83 136.26,111.06 127.37,111.06 120.93,104.62 120.93,99.95 U44.4
D4  (via drill 0.35)
  Top 0.3: v161.86,100.12 162.01,99.98 U114.1
  Bottom 0.3: J34.4 149.29,105.2 153.92,100.58 161.41,100.58 v161.86,100.12
D5
  Bottom 0.3: J34.3 146.75,113.84 145.18,112.27 145.18,101.67 148.42,98.43 149.92,98.43 J29.3
D6
  Bottom 0.3: J34.2 144.21,101.54 138.62,95.94 J30.3
D7  (via drill 0.35)
  Top 0.3: v161.33,99.61 161.36,99.58 U114.2
  Bottom 0.3: J34.1 143.18,116.5 147.3,116.5 148.05,115.75 148.05,105.6 153.57,100.09 160.85,100.09 v161.33,99.61
D8
  Top 0.3: J33.10 134.29,111.59 126.82,111.59 117.81,102.59 110.7,102.59 108.02,99.9 108.02,93.62 U43.4
D9
  Top 0.3: J33.9 132.32,112.17 126.52,112.17 117.62,103.27 109.09,103.27 U45.4
D10
  Top 0.3: U6.4 125.26,112.72 130.34,112.72 J33.8
D11
  Top 0.3: J33.7 128.37,113.29 110.78,113.29 U46.4
D12  (via drill 0.35)
  Top 0.3: v142.19,110.51 158.02,110.51 160.71,107.82 U114.3
  Bottom 0.3: J33.6 132.01,110.52 v142.19,110.52 v142.19,110.51
D13  (via drill 0.35)
  Top 0.3: v143,109.78 157.63,109.78 160.06,107.35 U114.4
  Bottom 0.3: J33.5 130.21,109.78 v143,109.78
DIG1
  Top 0.3: U3.12 89.9,156.93 109.99,156.93 110.76,156.16 112.97,156.16 U7.1
DIG2
  Top 0.3: U3.9 100.31,151.11 U7.5
DIG3  (via drill 0.35)
  Top 0.3: v109.71,150.52 110.39,149.84 U7.6
  Bottom 0.3: U3.8 103.44,150.52 v109.71,150.52
DIG4  (via drill 0.35)
  Top 0.3: v111.32,148.32 111.57,148.57 U7.7
  Bottom 0.3: U3.6 101.61,148.32 v111.32,148.32
DP  (via drill 0.35)
  Top 0.3: v117.38,156.09 117.48,156.19 U7.16
  Bottom 0.3: U3.3 95.49,149.82 111.11,149.82 v117.38,156.09
E
  Top 0.3: U3.1 90.17,149.58 103.66,149.58 107.09,146.14 114.18,146.14 115.21,147.17 115.21,150.53 117.06,152.38 U7.13
F  (via drill 0.35)
  Top 0.3: v117.48,153.29 117.84,153.65 U7.14
  Bottom 0.3: U3.10 94.84,156.79 101.8,156.79 103.45,155.14 104.71,155.14 106.35,156.79 118.08,156.79 118.71,156.16 118.71,154.51 v117.48,153.29
G  (via drill 0.35)
  Top 0.3: U7.15 118.01,154.92 v117.36,154.27
  Bottom 0.3: U3.5 99.98,149.23 112.28,149.23 117.32,154.27 v117.36,154.27
GND3  (via drill 0.35)
  Top 1.016: U5.3 164.94,152.41 164.02,151.5 164.02,146.72 165.04,145.7 168.06,145.7 169.31,146.95 C15.2 169.41,147.56
  other vias: 146.03,158.38 151.48,158.41 158.11,158.38 165.93,158.55 176.24,159.74 176.01,156.78 176.01,151.81 176.21,146.83 174.84,146.08 166.1,143.28 156.86,143.18 150.86,143.28 161.28,143.28 143.7,146.73 144.06,151.3 143.39,155.37 163.36,151.01 172.49,146.51 156.35,148.57
  pour Top (no thermals): 139.23,162.95 182.26,162.95 182.26,139.57 139.23,139.57
  pour Bottom (no thermals): 138.93,162.85 182.26,162.85 182.26,139.47 138.93,139.47
GND4  (via drill 0.35, 0.41, 0.8 pad 0.85)  (12 unrouted)
  Top 0.2: v115.24,160.6 115.22,160.59 115.22,159.57 C16.2 | C19.2 119.14,159.47 v119.51,159.83
  Top 0.3: U121.3 v229.69,50.71 | v111.43,152.34 111.46,152.38 U7.4 v114.61,152.38 | 226.49,113.98 R56.1 R57.1 225.46,114.16 v225.46,114.89 | v228.29,115.54 228.33,115.59 U11.4 228.33,117.95 v227.62,118.66 | R65.1 | R65.1 v203.72,58.19 | Q10.2 203.8,59.23 R65.1
  Top 0.4: v119.23,36.49 119.31,36.41 U12.2 U12.3 | U12.4 119.15,33.87 v119.13,33.89 | R69.1 126.94,22.68 v127.13,22.49 | R71.1 129.35,35.87 v130.03,35.19 | R6.1 88.36,13.38 v88.36,12.19
  Top 0.406: R27.1 62.13,112.71 J6.4 | R43.2 v62.85,125.85 | J19.4 63.3,80.87 62.72,80.87 60.3,78.46 R29.1 | R75.2 62.64,92.84 v62.74,92.95 | R78.2 62.78,59.77 v62.85,59.7 | R31.1 64.38,49.41 J23.4
  Top 0.5: R32.1 202.94,79.7 v203.87,80.62 | C32.1 188.83,25.19 v188.78,25.24 | U8.1 230.23,55.75 C22.1 231.85,55.81 v232.79,55.81 | C209.1 235.48,55.2 v235.49,55.21 | C20.1 226.42,55.69 C21.1 225.55,55.75 v225.49,55.81 | R238.1 v225.49,50.81 | C18.2 130.39,38.96 v130.43,38.99 | C8.1 98.44,17.39 v99.76,17.39 | 94.76,36.12 J25.4 | Q1.2 55.55,156.92 v54.64,157.82 | R17.1 58.42,160.16 v58.47,160.11 | C14.2 v117.48,142.68 | C13.2 119.09,143.67 v119.09,142.72 | C25.1 221.37,125.87 v221.36,125.88
  Top 0.61: C4.1 R6.1 87.04,13.41 R4.1 | U2.7 86.99,27.1 C1.2 87.2,31.01 89.36,33.17 92.41,33.17 J1.3 | C2.2 97.48,30.14 95.96,31.66 95.96,34.92 94.76,36.12 | C31.1 191.98,13.63 193.38,15.03 RP1.1
  Top 0.762: C10.2 C6.1 84.19,28.25 R13.2 83.47,30.52 C7.1 83.47,32.16 82.68,32.94 D1.1 83.76,35.12 U1.1 83.12,36.59 C11.1
  other vias: 100.56,30.79 83.23,19.13 82.88,29.1 82.46,35.54 82.82,27.06 85.48,48.23 91.22,28.31 93.42,39.73 96.25,44.92 100.21,43.91 52.51,148.5 58.5,146.11 57.6,153.12 46.65,144.56 201.77,54.22 199.04,51.46 87.03,144.75 86.51,158.12 108.49,158.47 108.31,152.73 108.56,143.98 123.19,157.77 122.66,146.01 112.3,158.64 109.47,155.91 204.94,82.22 200.25,87.26 201.4,76.9 200.28,47.64 208.93,58.42 197.59,57.72 231.85,120.75 233.43,124.5 224.08,122.68 225.03,117.57 233.39,111.65 226.15,126.53 102.61,153.43 100.09,152.55 91.9,153.22 94.73,150.38 213.8,29.49 241.52,4.68 18.92,4.61 18.92,166.48 241.52,166.52 86.58,56.34 172.12,56.41
  pour Top (isolate 0.254, rank 3): 269.66,179.58 -13.36,179.58 -13.36,-11.52 269.66,-11.52
  pour Bottom (isolate 0.254, rank 3): 269.66,179.58 -13.36,179.58 -13.36,-11.52 269.66,-11.52
  pour Top (isolate 0.254, no thermals): 101.88,50.16 101.88,6.98 81.61,6.98 arc-90 81.56,7.03 81.56,50.16
  pour Bottom (isolate 0.254, no thermals): 101.88,50.16 101.88,6.98 81.56,6.98 81.56,50.16
  pour Bottom (no thermals): 66.22,141.16 35.66,141.16 35.66,162.25 66.22,162.25
  pour Top (no thermals): 66.12,141.16 35.66,141.16 35.66,162.25 66.12,162.25
  pour Bottom (isolate 0.254, no thermals): 127.88,162.11 76.55,162.11 76.55,140.69 127.88,140.69
  pour Top (isolate 0.254, no thermals): 127.6,162.11 76.52,162.11 76.52,140.59 127.6,140.59
  pour Top (no thermals): 46.98,107.99 67.3,107.99 67.3,128.57 46.98,128.57
  pour Top (no thermals): 46.94,74.99 67.26,74.99 67.26,95.57 46.94,95.57
  pour Top (no thermals): 46.99,41.99 67.31,41.99 67.31,62.57 46.99,62.57
  pour Top (isolate 0.406, no thermals): 216.3,128.53 237.43,128.53 237.43,108.21 216.3,108.21
  pour Bottom (isolate 0.406, no thermals): 216.3,128.53 237.43,128.53 237.43,108.21 216.3,108.21
  pour Top (isolate 0.254, no thermals): 192.47,95.32 212.79,95.32 212.79,75 192.47,75
  pour Bottom (isolate 0.254, no thermals): 192.47,95.32 212.79,95.32 212.79,75.13 192.47,75.13
  pour Bottom (no thermals): 212.89,63.69 190.97,63.69 190.97,40.83 212.89,40.83
  pour Top (no thermals): 212.89,63.69 190.97,63.69 190.97,40.83 212.89,40.83
  pour Top (no thermals): 242.03,29.25 181.24,30.58 181.24,7.72 242.03,7.72
  pour Bottom (no thermals): 242.13,29.45 181.34,29.45 181.34,7.92 242.13,7.92
  pour Bottom (isolate 0.254, no thermals): 114.35,6.94 136.67,6.8 136.41,50.31 114.09,50.44
  pour Top (isolate 0.254, no thermals): 114.55,6.8 136.77,6.8 136.51,50.44 114.29,50.44
  pour Bottom (isolate 0.254, no thermals): 217.49,62.31 237.35,62.31 237.35,42.12 217.49,42.12
  pour Top (isolate 0.254, no thermals): 217.49,62.31 237.35,62.31 237.35,41.99 217.49,41.99
  pour Bottom (no thermals): 46.99,42.12 67.31,42.12 67.31,62.44 46.99,62.44
  pour Bottom (no thermals): 46.94,75.12 67.26,75.12 67.26,95.44 46.94,95.44
  pour Bottom (no thermals): 46.98,108.12 67.3,108.12 67.3,128.44 46.98,128.44
GND5  (via drill 0.35)  (1 unrouted)
  Top 0.762: 33.82,126.96 33.12,126.96 33.03,127.05 R35.1 32.48,127.14 Q2.2 | R38.2 28.16,122.85 v28.11,122.79 | Q4.2 32.09,93.98 R34.1 32.87,93.89 33.4,94.42 | R42.2 v27.97,89.8 v27.98,89.79
  other vias: 23.62,122.64 26.51,112.87 38.02,124.96 37.66,92.15 25.39,79.95 23.24,88.95 33.46,94.45
  pour Bottom (no thermals): 20.61,106.7 43.6,106.7 43.6,129.44 20.74,129.44 20.61,110.39
  pour Top (no thermals): 20.74,129.44 43.6,129.56 43.6,106.7 20.61,106.7
  pour Bottom (no thermals): 20.61,73.75 43.6,73.75 43.6,96.49 20.74,96.49 20.61,77.44
  pour Top (no thermals): 20.74,96.49 43.6,96.61 43.6,73.75 20.61,73.75
GND6  (via drill 0.35)
  Top 0.762: Q6.2 32.11,60.93 R45.1 33.46,60.73 | R48.2 28.04,57.71 v28.04,56.84
  other vias: 24.12,49.32 23.45,53.76 37.35,60.4 33.45,61.5
  pour Bottom (no thermals): 20.65,40.74 43.64,40.74 43.64,63.48 20.78,63.48 20.65,44.43
  pour Top (no thermals): 20.78,63.48 43.64,63.6 43.64,40.74 20.65,40.74
GND8  (via drill 0.35)
  Top 0.406: C24.1 202.23,120.69 v202.19,120.73
  pour Top (no thermals): 192.48,108.33 212.8,108.33 212.8,128.65 192.48,128.65
  pour Bottom (no thermals): 192.48,108.33 212.8,108.33 212.8,128.65 192.48,128.65
GND10  (via drill 0.3, 0.35)
  Top 0.2: U4.7 227.25,85.33 v227.25,86.07 227.55,86.07 227.77,85.86 U4.6
  Top 0.3: U14.1 v227.28,90.62 v227.27,90.61 | C34.1 230.64,94.19 v230.6,94.23
  Top 0.4: C33.1 U14.1
  other vias: 222.01,88.29 236.43,90.17 225.78,90.52 234.46,87.53 233.42,84.73 232.41,87.3 220.75,79.74
  pour Bottom (isolate 0.254, no thermals): 217.06,74.45 237.56,74.32 237.43,95.53 216.93,95.65
  pour Top (isolate 0.254, no thermals): 217.06,74.32 237.56,74.32 237.43,95.65 216.93,95.65
GND14  (via drill 0.35, 0.41, 0.6)
  Top 0.61: v45.15,24.51 25.85,24.51 | 25.85,16.89 v45.15,16.89 | v45.15,19.43 25.85,19.43 | v45.15,21.97 25.85,21.97 | v45.15,14.35 25.85,14.35
  Top 0.7: v55.85,16.33 58.13,16.33 J2.4
  Bottom 0.61: 46.88,24.51 v45.15,24.51 | v45.15,16.89 46.09,16.89 | v45.15,16.89 45.99,16.89 | v45.15,19.43 48.16,19.43 | v45.15,16.89 48.2,16.89 | v45.15,21.97 48.19,21.97 | 46.97,14.35 v45.15,14.35
  Bottom 0.7: v45.15,24.51 46.72,24.51 48.19,23.05 48.19,21.97 48.19,19.46 48.16,19.43 48.2,19.39 48.2,17.87 | 48.2,17.87 48.2,16.89 48.2,15.58 46.97,14.35 | 48.2,17.87 54.31,17.87 v55.85,16.33
  other vias: 50.99,25.23 50.91,20.39 50.88,11.17
  pour Bottom (no thermals): 63.3,29.73 63.3,8.78 20.92,8.78 20.92,29.73
  pour Top (no thermals): 46.2,31.13 63.29,31.13 63.29,8.65 46.2,8.65
GND15  (via drill 0.35, 0.51)
  Top 1: v163.72,36.42 163.72,35.67 C17.1 164.73,35.71 v164.73,36.39
  other vias: 167.39,36.07
  pour Top (isolate 0.254, no thermals): 169.88,50.1 169.88,6.92 149.61,6.92 arc-90 149.56,6.97 149.56,50.1
  pour Bottom (isolate 0.254, no thermals): 169.88,50.1 169.88,6.92 149.56,6.92 149.56,50.1
GND16  (via drill 0.35)
  Top 0.2: v145.2,73.17 145.2,72.42 C28.1 145.97,72.42 v145.97,73.17 | C38.2 147.37,71.9 147.37,72.54 v146.99,72.93 | v158.88,75.83 158.88,75.16 C41.1 159.17,75.1 v159.91,75.83 | C43.2 160.64,75.55 v160.88,75.8 | R61.1 148.41,72.24 v147.72,72.93 | v157.45,97.04 v157.46,97.05 U114.8
  Top 0.3: D7.- 112.27,66.56 v112.27,67.61 | v150.39,71.47 150.74,71.82 U9.2 | U9.2 150.74,71.85 v151.13,71.46 | U9.2 150.74,73.48 v150.72,73.5 v150.73,73.5 v151.43,73.5
  Top 0.5: K7.P$2 107.01,68.02 v107.09,68.1
  Top 0.8: J37.1 J36.1 J27.1 J18.1
  other vias: 155.25,96.97 156.09,96.97 144.05,65.65 155.84,65.12 155.67,68.97 162.25,69.08 156.3,77.02 161.55,79.4 158.68,94.31 161.58,80.77 121.51,66.66 117.06,65.19 109.54,67.92 99.77,67.12 128.09,85.04 128.16,75.31 124.69,75.13 124.48,85.21 124.69,94.28 125.25,102.89 119.76,103.03 122.7,111.6 127.88,106 118.18,95.15 106.95,98.55 112.83,114.51 136.21,112.3 157.91,111.32 139.64,116.01 138.38,72.3 153.11,68.62 163.84,79.78 163.84,87.06 143.19,113.57 148.67,116.61 156.09,116.57 155.7,112.55 133.97,65.05 132.15,72.33 128.93,72.37 130.47,68.48 103.66,76.43 103.52,85.07 103.45,94.98 103.52,103.55 109.36,97.95 108.91,80.63 107.3,78.67 109.43,73.14 107.37,74.61 118.22,85.39 119.86,98.34 118.5,76.74 118.15,80.21 119.13,71.91 119.27,106.95 135.58,72.26 141.46,72.3
  pour Top (isolate 0.254, rank 2, no thermals): 166.48,119.76 91.39,119.76 91.39,62.23 166.48,62.23
  pour Bottom (isolate 0.254, rank 2, no thermals): 166.48,119.76 91.39,119.76 91.39,62.23 166.48,62.23
GND18
  Top 0.5: 215.14,155.06 C46.2
  Top 0.8: J11.4 213.47,145.9 215.14,147.57 215.14,154.85 | 215.14,154.85 215.14,155.06 | J16.P$1 213.87,158.44 213.87,156.11 215.14,154.85
  pour Top (no thermals): 194.89,163.47 237.91,163.47 237.91,140.12 194.89,140.12
  pour Bottom (no thermals): 194.59,163.4 237.91,163.4 237.91,140.02 194.59,140.02
HSCL  (1 unrouted)
  Top 0.3: J13.1 223.19,78.91 231.68,78.91 R51.1 235.35,80.41 Q9.3 | Q5.3 227.31,44.19 R53.1 221.5,49.11 J14.1
HSDA  (via drill 0.35)  (1 unrouted)
  Top 0.3: J13.2 221.57,84.21 v226.77,89.41 | v232.97,90.21 232.09,89.33 Q8.3 233.02,90.18 R52.1 | J14.2 222.09,51.11 224.13,49.07 R60.1 227.25,49.07 Q3.3
  Bottom 0.3: v226.77,89.41 232.17,89.41 v232.97,90.21
N$1
  Top 0.2: U4.2 230.75,84.16 R82.2
N$2
  Top 0.406: R26.2 208.2,118.1 U10.3
N$3
  Top 0.3: C209.2 231.77,54.09 R113.1 231.75,52.05 231.89,51.91 U121.5
N$4  (1 unrouted)
  Top 0.406: K2.P$1 53.42,109.8 60.71,109.8 | R68.2 62.11,109.86 R27.2
N$5
  Top 0.5: R16.2 Q1.1
N$6
  Top 0.5: R18.2 50.03,142.83 D2.+
N$8
  Top 0.762: R41.1 32.39,89.51 31.35,89.51 29.81,87.97 29.81,85.13 LED2.+ 29.77,82.7 R33.2
N$10
  Top 0.762: R37.1 32.27,122.5 29.68,119.91 LED1.+ 29.68,115.14 R28.2
N$11
  Top 0.3: R38.1 26.64,122.99
  Top 0.61: R38.1 26.6,123.79 26.6,123.03
  Top 0.762: Q2.3 28.26,126.19 26.6,124.53 26.6,123.03 | 26.64,122.99 26.64,118.69 26.94,118.39 | 26.94,118.39 | 26.94,118.39 LED1.-
N$12
  Top 0.762: R35.2 31.08,125.53 Q2.1 29.88,124.32 R36.2
N$13
  Top 0.3: R297.1 162.01,90.92 U114.16
N$14
  Top 0.406: K4.P$1 53.29,43.95 R31.2 R80.2
N$15
  Top 0.762: Q4.3 26.45,91.11 R42.1 26.45,85.89 LED2.-
N$16
  Top 0.61: U2.3 92.07,22.36 92.65,21.78 R11.1
N$17
  Top 0.762: R47.1 33.35,55.52 LED3.+ 30.21,51.98 32.01,50.19 R44.2
N$18  (via drill 0.35)
  Top 0.61: C2.1 97.48,23.36 R11.2 96.41,23.3 v96.39,23.33 | U2.4 90.8,25.09 91.21,25.49 v91.21,25.57
  Bottom 0.61: v91.21,25.57 95.57,25.57 96.39,24.75 v96.39,23.33
N$19
  Top 0.762: LED3.- 26.51,52.75 R48.1 26.51,57.92 28.53,59.94 Q6.3
N$20
  Top 0.762: R45.2 30.75,59.21 Q6.1 30.56,58.99 29.54,57.97 R46.2
N$21
  Top 0.61: U2.2 93.34,24.65 92.32,25.67 R1.2
N$22
  Top 0.61: U2.6 88.26,25.76 R2.2
N$23
  Top 0.61: U2.5 89.53,25.5 R2.1 89.84,26.63 89.15,27.31 C1.1
N$24  (via drill 0.35)
  Top 0.61: 97.73,39.44 v97.73,35.93 C3.2 | R15.3 98.43,40.14 97.73,39.44 | R15.2 97.58,39.29 97.73,39.44 | U2.12 89.53,20.33 v90.39,21.2
  Bottom 0.61: v97.73,35.93 97.73,22.34 96.59,21.2 v90.39,21.2
N$25  (via drill 0.35)
  Top 0.61: C3.1 R10.2 99.21,33.16 v99.21,24.55 R5.2 | U2.13 90.8,19.27 v91.61,20.08
  Bottom 0.61: v99.21,24.55 99.21,20.99 98.29,20.08 v91.61,20.08
N$26
  Top 0.61: U2.9 85.72,20.28 83.77,22.23 R3.2
N$27
  Top 0.61: U2.10 86.99,14.88 R4.2
N$28  (via drill 0.35)
  Top 0.61: R12.2 89.96,13.46 R6.2 C4.2 | 89.91,15.69 v89.89,15.92
  Top 0.762: C4.2 89.91,15.69
  Bottom 0.762: J1.2 89.98,31.04 88.06,29.12 88.06,18.45 89.89,16.62 v89.89,15.92
N$29
  Top 0.61: R7.1 C5.1 94.61,15.49 U2.16 94.61,19.22 95.19,19.8 C9.2
N$30
  Top 0.61: U2.15 93.34,15.33 C5.2 R7.2 93.29,13.13 93.74,12.68 95.88,12.68 96.42,13.22 R8.2
N$31
  Top 0.762: C9.1 99.21,19.85 R5.1
N$32
  Top 0.5: C8.2 96.57,15.31 R8.1
N$33
  Top 0.61: U2.1 94.61,24.57 R9.2
N$34
  Top 0.61: U2.14 92.07,15.54 R12.1
N$35
  Top 0.762: U1.3 84.64,38.14 C11.2 84.79,39.75 R14.1
N$36
  Top 0.61: R15.1 99.64,35.12 R10.1
N$37
  Top 0.762: R34.2 30.69,92.37 Q4.1 29.48,91.16 R39.2
N$38
  Top 0.5: R32.2 201.42,79.57 203.67,81.82 203.67,86.53 K1.1
N$40
  Top 0.2: U4.12 227.24,83.47 227.24,83.15 228.73,81.67 R84.2
N$41
  Top 0.406: K2.P$3 59.91,125.42 R43.1 60.33,125.64 R67.1
N$42
  Top 0.3: U114.15 161.36,91.09 R292.1
N$45
  Top 0.3: MIC1.1 234.49,121.46 R54.1 234.52,120.19 C23.1
N$46
  Top 0.3: R56.2 226.73,112.23 226.97,111.99 U11.5 228.33,113.64 229.13,114.44 230.37,114.44 231.28,115.35 232.85,115.35 C23.2
N$47  (via drill 0.35)
  Top 0.3: R57.2 225.13,111.93 226.88,110.18 229.24,110.19 229.6,110.56 U11.6 229.55,112.04 v229.55,113.7 | R59.2 235.18,115.91 v234.31,115.03
  Bottom 0.3: v234.31,115.03 234.31,113.95 233.54,113.18 230.95,113.18 230.43,113.7 v229.55,113.7
N$48
  Top 0.3: D5.2 227.36,114.96 230.25,114.96 230.87,115.59 U11.2 U11.1
N$49  (via drill 0.35)
  Top 0.3: U11.7 230.87,113.94 v231.25,114.32 231.34,114.4 232.99,114.4 R59.1 | v229.62,115.65 229.62,117.21 U11.3
  Bottom 0.3: v231.25,114.32 230.95,114.32 v229.62,115.65
N$50
  Top 0.3: U114.14 160.71,91.78 159.54,90.62 R293.1
N$51
  Top 0.3: R294.1 158.86,91.43 159.67,91.43 160.06,91.81 U114.13
N$52
  Top 0.5: D7.+ R63.2
N$53
  Top 0.3: Q10.3 207.42,57.08 BUZZER1.-
  Top 0.5: D4.+ 201.54,51.2 BUZZER1.-
N$54
  Top 0.5: D4.- 204.93,45.04 R66.1 206.55,45.04 206.25,45.35 BUZZER1.+
N$59
  Top 0.4: R71.2 129.21,28.59 R73.1
N$60
  Top 0.2: U4.3 229.95,84.66 R83.2
N$61
  Top 0.4: R72.1 127.79,32.25 R73.2
N$62
  Top 0.4: U12.5 125.68,33.87 123.18,31.37 R73.3
N$63
  Top 0.4: R74.1 D6.+
N$64
  Top 0.4: U12.6 125.45,35.14 121.43,31.12 121.43,25.71 R69.2 123.96,22.17 L3.1
N$70
  Top 0.406: K3.P$1 53.25,76.94 59.87,76.94 | 59.87,76.94 R29.2 | R77.2 59.88,76.93 59.87,76.94
N$71
  Top 0.406: K3.P$3 57.18,92.84 R75.1 61.42,91.55 R76.1
N$86  (via drill 0.35)
  Top 0.2: U4.1 229.92,83.66 v230.67,82.91 | v229.77,80.21 229.67,80.11 R85.2
  Bottom 0.2: v230.67,82.91 230.67,81.11 v229.77,80.21
N$258
  Top 0.3: U121.2 229.05,51.91 R238.2
  Top 0.5: R237.1 227.95,50.99 R238.2
N$274
  Top 0.3: R297.2 162.31,82.88 J40.2
N$275
  Top 0.3: R292.2 161.31,88.68 161.31,83.88 J40.3
N$276
  Top 0.3: R293.2 160.76,87.81 160.76,85.32 J40.4
N$277
  Top 0.3: R294.2 159.37,87.79 J40.5
N$278  (via drill 0.35)
  Top 0.5: v216.51,156.75 216.64,156.61 R299.1
  Bottom 0.5: J16.P$2 216.51,158.35 v216.51,156.75
N$289
  Top 0.3: R22.1 148.93,71.17 149.79,70.31 U9.4
N$290
  Top 0.3: U9.6 151.89,69.99 C39.1 152.87,71.04 153.89,71.04 L7.1
  pour Top: 151.47,70.44 152.2,71.18 153.18,71.18 153.81,71.81 154.41,71.81 154.9,71.32 154.9,69.53 154.65,69.29 151.71,69.29 151.47,69.53
N$291
  Top 0.3: U9.1 152.24,72.49 C39.2
N$292
  Top 0.2: R62.1 156.83,74.33 C40.1 156.41,74.29 156.22,74.1 150.35,74.1 149.79,73.55 U9.3 149.79,73.37 149.75,73.41 148.88,73.41 R61.2 148.63,73.16
N$294
  Top 0.406: K4.P$3 57.16,59.77 R78.1 61.42,58.72 R79.1
NC  (4 unrouted)
  Bottom 1.524: J5.5 32.17,145.58 J3.1
NO
  Bottom 1.524: J3.3 37.85,156.82 J5.4
OUT
  Top 0.3: R55.3 156.73,30.54 154.13,27.94 154.13,24.17 160.08,18.21 J21.4
  Top 0.4: J22.1 156.56,40.43 156.73,40.26
  Top 0.406: 156.73,40.26 R55.3
POUT_5V
  Top 0.2: C43.1 160.63,73.35 C41.2 158.61,73.91 158.08,73.91 C40.2 157.72,74.32 R62.2
  Top 0.5: U114.9 157.46,93.54 157.03,93.96 156.62,93.96 | 156.62,93.96 155.99,93.96 155.82,93.79 | 156.05,93.39 156.62,93.96
  Top 1: C43.1 161.34,73.36 162.28,74.29 162.28,76.85 161.19,77.93 J40.1 157.62,77.93 156.05,79.51 156.05,93.21 | C176.1 155.82,93.79 156.05,93.56 156.05,93.39 156.05,93.21 | C176.1 155.2,93.69 151.7,93.69 149.87,95.52 J29.2 | J29.2 149.87,95.71 | J30.2 133.91,95.46 135.72,93.65 147.88,93.65 149.87,95.64 J29.2 | C176.1 155.57,93.7 156.05,93.21
  Top 1.3: J30.2 133.91,97.87 132.95,98.83 128.26,98.83 126.38,96.95 126.41,96.93 D8.-
  pour Top: 156.82,73.35 158.26,73.35 158.75,73.84 160.95,73.84 161.16,73.63 161.16,71.32 159.34,69.5 157.03,69.5 156.82,69.71
RES
  Top 0.3: K7.P$3 102.62,67.01 110.66,67.01 111.92,68.27 127.47,68.27 J35.3
SCL  (via drill 0.3)  (3 unrouted)
  Top 0.2: U4.13 227.77,83.23 228.65,82.36 231.46,82.36 232.22,83.11 232.81,83.11 232.91,83.21 v233.69,83.21 | U7.2 114.49,154.92 116.01,156.44 116.01,157.68 115.69,158.01 | 115.69,158.01 C16.1 115.97,158.8 115.97,160.71 116.49,161.23 120.05,161.23 121.44,159.84 121.44,156.19 122.84,154.79 J7.1 | R20.2 115.69,158.01
  Top 0.3: 174.92,153.96 177.78,153.96 J15.1 | U121.6 233.19,52.41 233.94,51.66 233.94,47.67 232,45.72 | 232,45.72 R30.1 | Q5.2 231.98,45.74 232,45.72
  Top 0.305: R24.1 169.51,154.27 | R24.1 169.08,153.96 168.09,154.95 U5.4 | Q9.2 234.71,83.61 R50.1 234.31,83.21 v233.69,83.21 | R24.1 174.92,153.96 175.06,153.96
SDA  (via drill 0.35)  (3 unrouted)
  Top 0.2: U4.14 228.83,82.93 v229.82,82.93 | 231.07,89.37 231.07,89.91 232.04,90.87 R49.2 | U7.3 114.17,153.65 116.4,155.88 116.4,157.25 R21.2 | R21.2 C19.1 | C19.1 | R21.2 116.33,158.7 116.33,160.5 116.7,160.87 119.91,160.87 121.09,159.69 121.09,155.67 J7.2
  Top 0.3: 175,152.54 178.36,152.54 J15.2 | v230.07,87.41 230.17,87.51 230.17,88.41 Q8.2 231.07,89.37 | Q3.2 231.76,49.09 R25.2 233.28,50.35 233.28,51.12 232.99,51.41 U121.4
  Top 0.305: 169.06,152.54 166.38,149.87 U5.2 | 169.06,152.54 R23.1 175,152.54 | 169.27,152.32 169.06,152.54
  Bottom 0.2: v230.07,87.41 230.07,83.18 v229.82,82.93
SIG  (11 unrouted)
  Top 0.3: C26.2 226.5,122.01 D5.1 223.57,119.09 J20.1 | J26.1 198.75,52.89 198.75,58.12 201.46,60.84 R65.2 204.01,61.13 Q10.1
  Top 0.4: J28.1 121.4,44.96 D6.- 124.31,36.41 U12.7 126.86,36.41 R70.2
  Top 0.406: J6.1 64.74,121.31 55.91,121.31 K2.P$2 | K4.P$2 55.83,55.41 J23.1 | K3.P$2 55.78,88.41 J19.1
  Top 0.5: J12.1 201.68,115.23 203.38,116.93 U10.1 | 186.58,14.71 184.98,16.31 J9.1 | C31.2 190.07,18.05 RP1.2 | R16.1 57.26,158.64 R17.2 57.95,158.64 61.79,154.79 J4.1 | R58.1 C25.2 C26.2
  Top 0.61: 186.58,14.71 187.66,13.63 C31.2
  Top 0.762: R46.1 31.38,58.01 34.11,58.01 34.87,57.25 R47.2 36.19,55.43 J10.1 | R39.1 31.15,90.78 33.37,90.78 34.13,90.02 R41.2 35.61,88.24 J17.1 | R36.1 33.83,123.8 34.81,122.83 R37.2 38.44,122.5 J8.1
SIG1
  Top 0.5: J24.1 198.17,82.32 198.77,82.92 202.2,82.92 K1.3
US_ECHO
  Top 0.5: J11.2 217.51,143.34 217.51,154.99 R299.2
US_TRIG
  Bottom 0.5: J16.P$3 217.67,145.1 J11.1
V+
  Top 0.5: R19.2 53.62,145.58 J5.1
V-
  Top 0.5: J5.3 52.25,157.83 55.19,154.89 Q1.3 55.95,154.33 D3.+ 54.62,151.61 54.62,149.19 52.52,147.09 49.62,147.09 48.5,145.98 D2.-
VCC  (via drill 0.35)  (10 unrouted)
  Top 0.2: R20.1 113.8,159.57 113.8,160.43 v113.79,160.45
  Top 0.3: R60.2 226.42,46.84 | 226.42,46.84 R53.2 | 226.42,46.84 226.32,46.74 225.47,46.74 v225.43,46.77 | R21.1 117.09,159.76 v117.65,160.32
  Top 0.4: U12.8 125.98,37.78 125.98,39.09 R74.2 126.05,39.26 127.45,39.26 C18.1 | R72.2 R70.1 129.31,37.4 | R70.1 130.73,35.93 130.73,23.44 L3.2
  Top 0.406: R68.1 60.68,113.25 J6.3 66,118.57 66,121.64 63.23,124.41 R67.2 | R76.2 64.21,91.41 65.86,89.76 65.86,85.43 J19.3 66.17,83.07 66.17,81.01 65.47,80.31 63.48,80.31 R77.1 | R79.2 64.14,58.33 66.21,56.27 66.21,52.73 64.88,51.41 | 64.88,51.41 J23.3 | R80.1 63.69,47.24 65.51,47.24 66.24,47.97 66.24,50.04 64.88,51.41
  Top 0.5: J24.3 198.07,86.32 198.99,85.4 K1.2 | J9.3 187.92,23.29 191.65,23.29 | 191.65,23.29 191.98,23.29 | J14.3 220.89,53.11 225.05,57.27 C21.2 227.16,57.27 U8.3 | J28.3 126.43,42.69 125.98,42.24 125.98,39.09 | C18.1 129.31,37.4 R70.1 | C32.2 191.6,23.33 191.65,23.29 | J4.3 57.1,150.79 D3.- 57.09,148.5 57.09,147.63 | 57.09,147.63 C12.2 | 57.09,147.63 57.09,147.53 R19.1 55.66,143.37 55.04,142.75 54.96,142.83 R18.1 | J7.3 121.73,148.57 U7.10 117.77,148.57 117.41,148.21 117.41,145.38 C14.1 C13.1 | J26.3 193.71,51.86 193.71,48.11 195.88,45.94 198.09,45.94 200.51,43.52 R66.2
  Top 0.61: RP1.3 237.83,20.62 235.16,23.29 191.98,23.29
  Top 0.8: R14.2 86.61,46.47 87.84,47.69 91.05,47.69 J25.3
  Bottom 0.3: v225.43,46.77 224.49,47.72 224.49,48.51 J14.3 | v113.79,160.45 114.58,159.66 116.99,159.66 v117.65,160.32 120.9,157.07 124.45,157.07 125.36,156.16 125.36,152.19 J7.3
  Bottom 0.5: 62.28,150.96 J4.3
VCC3
  Top 0.305: R24.2 169.23,155.77
  Top 0.5: R24.2 169.52,156.06 179.21,156.06 180.12,155.15 180.12,152.29 J15.3 169.67,150.79 169.4,150.52 | C15.1 169.31,150.71 R23.2
  Top 0.508: 169.4,150.52 169.26,150.66 R23.2 | C15.1 168.9,149.24 166.99,147.33 U5.1
VCC5  (1 unrouted)
  Top 0.762: J8.3 37.24,117.19 R28.1 | J17.3 37.84,84.24 R33.1
VCC6
  Top 0.762: R44.1 37.88,51.43 J10.3
VCC8
  Top 0.406: R26.1 C24.2
  Top 0.5: J12.3 203.32,119.23 C24.2
VCC14
  Top 0.5: 54.57,18.05 58.41,18.05 J2.3
  Top 0.61: R40.2 53.16,16.65 54.57,18.05
VCC15
  Top 1: 160.56,44.79 J22.3 160.56,42.76 166.03,37.3 166.03,34.81 164.62,33.4 C17.2 159.7,28.9 J21.2 | 159.46,26.56 J21.2 | J21.2 161.09,24.93 J21.3
VCC16
  Top 0.3: J35.5 132.75,65.4 118.55,65.4 R63.1
  Top 0.8: J18.2 J27.2 J36.2 J37.2
  Top 1: 116.85,71.77 U50.2 U49.2 | 116.71,71.91 114.72,69.92 103.89,69.92 101.87,71.94 U47.2 U48.2
  Top 1.3: 126.41,70.09 D8.+
  Top 1.5: J35.5 134.09,68.88 132.88,70.09 126.41,70.09 118.53,70.09 116.85,71.77 116.71,71.91
  Bottom 1: U48.2 U43.2 U45.2 U46.2 101.87,108.7 103.55,110.38 115.37,110.38 116.85,108.89 U6.2 | U49.2 U42.2 U44.2 U6.2 | U6.2 116.85,104.59 J18.2 129.14,104.59
VCC18
  Top 0.5: J16.P$4 218.47,157.99 216.48,157.99 C46.1 216.31,155.41 216.31,146.81 215.47,145.98 J11.3
VDD  (via drill 0.35)
  Top 0.61: 85.72,25.16 85.72,26.67 C10.1 | U2.11 88.26,19.98 85.72,22.52 U2.8 85.72,25.16 | R3.1 85.72,25.16 | J1.1 87.52,35.61 D1.2
  Top 0.762: U1.2 85.95,35.65 D1.2 85.95,32.58 85.94,32.58 C7.2 85.36,31.89 85.71,31.54 R13.1 85.71,28.25 C6.2 C10.1 | 89.79,35.61 J1.1 | R9.1 95.7,28.53 95.96,28.78 95.96,28.79 v96.18,29.02
  Bottom 1.016: v96.18,29.02 96.18,32.58 93.15,35.61 J1.1
VIN  (via drill 0.35)
  Top 0.3: R22.2 148.49,70.38 147.37,70.38 C38.1
  Top 0.5: U9.5 150.74,69.4 | R22.2 148.6,69.25
  Top 0.7: 150.74,69.4 150.14,68.8
  Top 1: J35.8 141.71,66.84 145.12,70.25 C28.2 | C28.2 147.24,70.25 C38.1 147.54,70.31 148.6,69.25 149.05,68.8 150.14,68.8 | C28.2 144.86,70.25 v144.15,70.97
  Bottom 1: v144.15,70.97 143.56,71.56 P1.P$1
(copper drawn outside any net)
  shapes: Bottom area x3